# EAGLE schematic f91_main_board_nf (EAGLE 7.5.0)
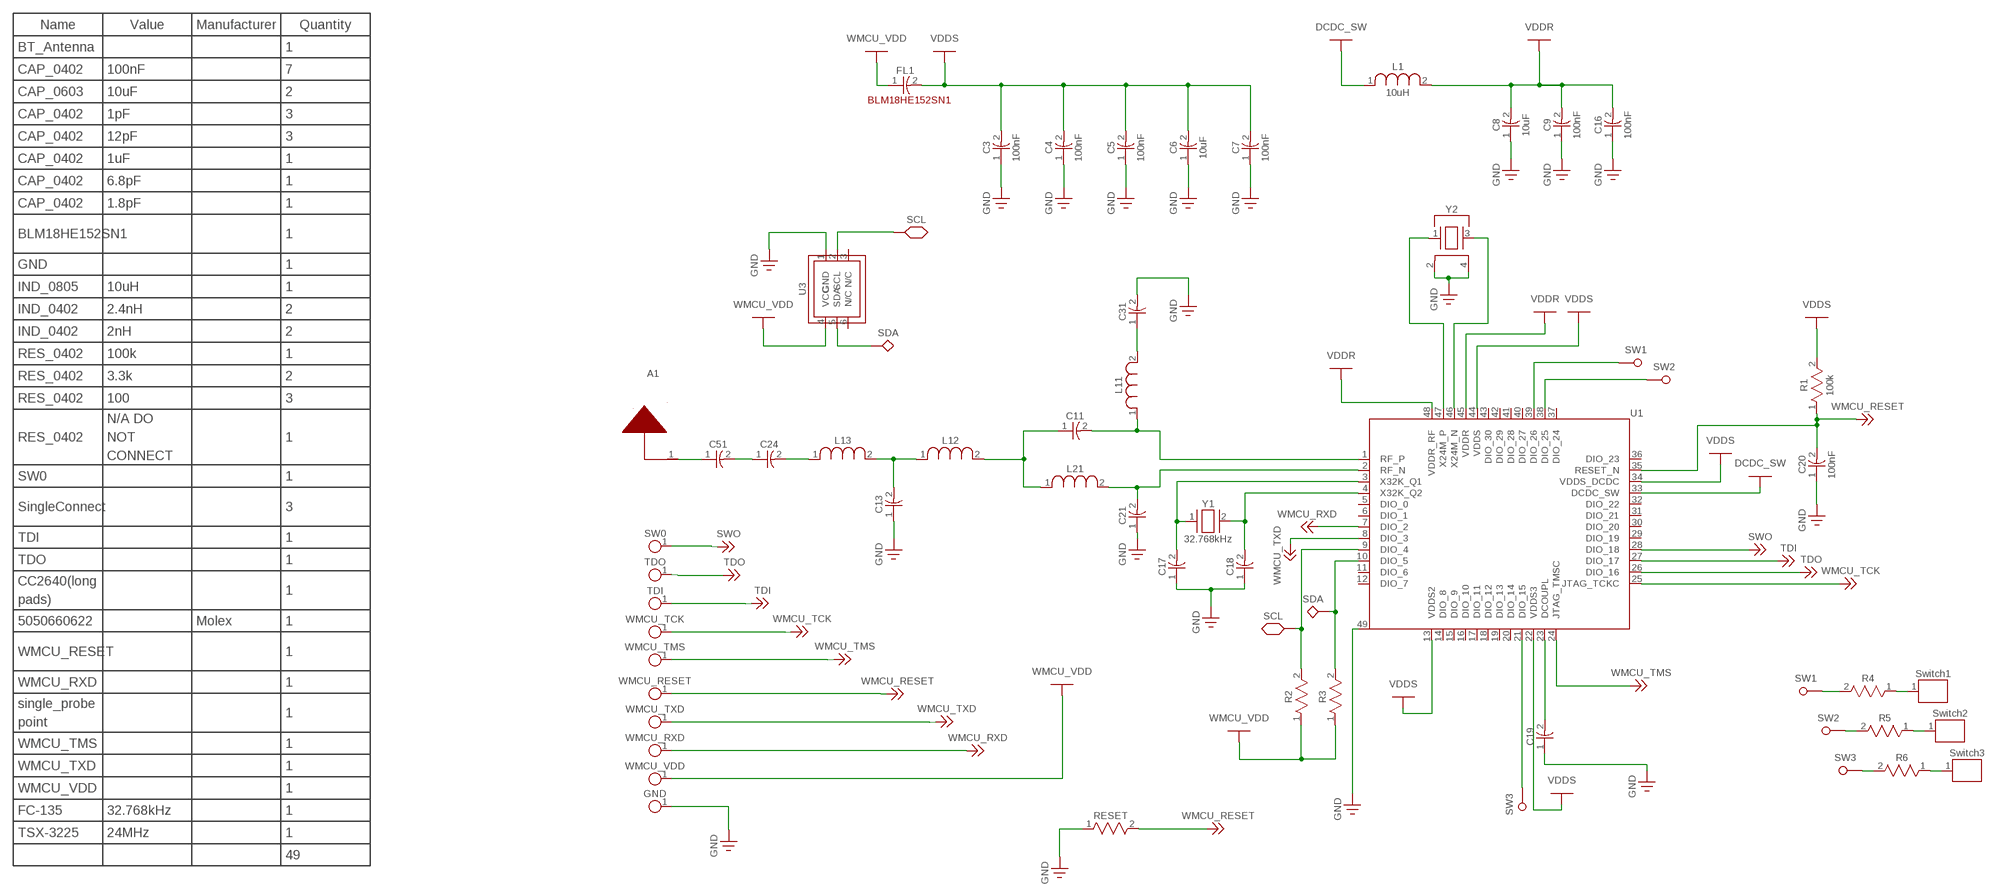
[diagram p0: schematic, sheet 1]

## Parts
A1  BT_ANTENNA  [BT_ANTENNA]
C3  100nF  CAP_0402  [CAP_0402]
C4  100nF  CAP_0402  [CAP_0402]
C5  100nF  CAP_0402  [CAP_0402]
C6  10uF  CAP_0603  [CAP_0603]
C7  100nF  CAP_0402  [CAP_0402]
C8  10uF  CAP_0603  [CAP_0603]
C9  100nF  CAP_0402  [CAP_0402]
C11  1pF  CAP_0402_20  [CAP_0402]
C13  1pF  CAP_0402_20  [CAP_0402]
C16  100nF  CAP_0402  [CAP_0402]
C17  12pF  CAP_0402_20  [CAP_0402]
C18  12pF  CAP_0402_20  [CAP_0402]
C19  1uF  CAP_0402_20  [CAP_0402]
C20  100nF  CAP_0402  [CAP_0402]
C21  1pF  CAP_0402_20  [CAP_0402]
C24  12pF  CAP_0402_20  [CAP_0402]
C31  6.8pF  CAP_0402_20  [CAP_0402]
C51  1.8pF  CAP_0402_20  [CAP_0402]
FL1  BLM18HE152SN1  [CAP_0603_31]
GND  GND  [SINGLE_PROBE_POINT]
L1  10uH  IND_0805  [IND_0805]
L11  2.4nH  IND_0402  [IND_0402]
L12  2nH  IND_0402  [IND_0402]
L13  2nH  IND_0402  [IND_0402]
L21  2.4nH  IND_0402  [IND_0402]
R1  100k  RES_0402  [RES_0402]
R2  3.3k  RES_0402_25  [RES_0402]
R3  3.3k  RES_0402_25  [RES_0402]
R4  100  RES_0402_26  [RES_0402]
R5  100  RES_0402_26  [RES_0402]
R6  100  RES_0402_26  [RES_0402]
RESET  N/A DO NOT CONNECT  RES_0402_25  [RES_0402]
SW0  SW0  [SINGLE_PROBE_POINT]
Switch1  SINGLECONNECT  [SINGLECONNECT]
Switch2  SINGLECONNECT  [SINGLECONNECT]
Switch3  SINGLECONNECT  [SINGLECONNECT]
TDI  TDI_45  [SINGLE_PROBE_POINT]
TDO  TDO_43  [SINGLE_PROBE_POINT]
U1  CC2640(LONG_PADS)  [RGZ0048A-VQFN-48(LONGER_PADS)]
U3  5050660622  [5050660622]
WMCU_RESET  WMCU_RESET_18  [SINGLE_PROBE_POINT]
WMCU_RXD  WMCU_RXD_48  [SINGLE_PROBE_POINT]
WMCU_TCK  SINGLE_PROBE_POINT  [SINGLE_PROBE_POINT]
WMCU_TMS  WMCU_TMS_6  [SINGLE_PROBE_POINT]
WMCU_TXD  WMCU_TXD_3  [SINGLE_PROBE_POINT]
WMCU_VDD  WMCU_VDD_23  [SINGLE_PROBE_POINT]
Y1  32.768kHz  FC-135  [FC-135]
Y2  24MHz  TSX-3225  [TSX-3225]

## Nets
Net_0: C3.1 C4.1 C5.1 C6.1 C7.1 C8.1 C9.1 C13.1 C16.1 C17.1 C18.1 C19.1 C20.1 C21.1 C31.2 GND.1 RESET.1 U1.49(GND) U3.1(GND) Y2.2 Y2.4 ; supply symbol labelled GND
Net_1: FL1.1 R2.1 R3.1 U3.4(VCC) WMCU_VDD.1 ; supply symbol labelled WMCU_VDD
Net_2: C3.2 C4.2 C5.2 C6.2 C7.2 FL1.2 R1.2 U1.13(VDDS2) U1.22(VDDS3) U1.34(VDDS_DCDC) U1.44(VDDS) ; supply symbol labelled VDDS
Net_3: L1.1 U1.33(DCDC_SW) ; supply symbol labelled DCDC_SW
Net_4: C8.2 C9.2 C16.2 L1.2 U1.45(VDDR) U1.48(VDDR_RF) ; supply symbol labelled VDDR
Net_5: U1.25(JTAG_TCKC) WMCU_TCK.1 ; supply symbol labelled WMCU_TCK
Net_6: U1.24(JTAG_TMSC) WMCU_TMS.1 ; supply symbol labelled WMCU_TMS
Net_7: C20.2 R1.1 RESET.2 U1.35(RESET_N) WMCU_RESET.1 ; supply symbol labelled WMCU_RESET
Net_8: C17.2 U1.3(X32K_Q1) Y1.1
Net_9: C18.2 U1.4(X32K_Q2) Y1.2
Net_10: C19.2 U1.23(DCOUPL)
Net_11: U1.47(X24M_P) Y2.1
Net_12: U1.46(X24M_N) Y2.3
Net_13: C21.2 L21.2 U1.2(RF_N)
Net_14: C11.2 L11.1 U1.1(RF_P)
Net_15: C31.1 L11.2
Net_16: C11.1 L12.2 L21.1
Net_17: C13.2 L12.1 L13.2
Net_18: C24.2 L13.1
Net_19: C24.1 C51.2
Net_20: A1.1 C51.1
Net_21: U1.7(DIO_2) WMCU_RXD.1 ; supply symbol labelled WMCU_RXD
Net_22: U1.8(DIO_3) WMCU_TXD.1 ; supply symbol labelled WMCU_TXD
Net_23: TDO.1 U1.26(DIO_16) ; supply symbol labelled TDO
Net_24: TDI.1 U1.27(DIO_17) ; supply symbol labelled TDI
Net_25: SW0.1 U1.28(DIO_18) ; supply symbol labelled SWO
Net_30: R3.2 U1.10(DIO_5) U3.5(SDA) ; supply symbol labelled SDA
Net_31: R2.2 U1.9(DIO_4) U3.2(SCL) ; supply symbol labelled SCL
Net_32: R6.2 U1.21(DIO_15) ; supply symbol labelled SW3
Net_33: R5.2 U1.38(DIO_25) ; supply symbol labelled SW2
Net_34: R4.2 U1.39(DIO_26) ; supply symbol labelled SW1
Net_35: R4.1 Switch1.1
Net_36: R5.1 Switch2.1
Net_37: R6.1 Switch3.1
Unconnected: U1.5(DIO_0) U1.6(DIO_1) U1.11(DIO_6) U1.12(DIO_7) U1.14(DIO_8) U1.15(DIO_9) U1.16(DIO_10) U1.17(DIO_11) U1.18(DIO_12) U1.19(DIO_13) U1.20(DIO_14) U1.29(DIO_19) U1.30(DIO_20) U1.31(DIO_21) U1.32(DIO_22) U1.36(DIO_23) U1.37(DIO_24) U1.40(DIO_27) U1.41(DIO_28) U1.42(DIO_29) U1.43(DIO_30) U3.3(N/C) U3.6(N/C)

## Notes on the sheet
- Name | Value | Manufacturer | Quantity
- BT_Antenna | 1
- CAP_0402 | 100nF | 7
- CAP_0603 | 10uF | 2
- CAP_0402 | 1pF | 3
- CAP_0402 | 12pF | 3
- CAP_0402 | 1uF | 1
- CAP_0402 | 6.8pF | 1
- CAP_0402 | 1.8pF | 1
- BLM18HE152SN1 | 1
- GND | 1
- IND_0805 | 10uH | 1
- IND_0402 | 2.4nH | 2
- IND_0402 | 2nH | 2
- RES_0402 | 100k | 1
- RES_0402 | 3.3k | 2
- RES_0402 | 100 | 3
- RES_0402
- N/A DO
  NOT
  CONNECT
- 1
- SW0 | 1
- SingleConnect | 3
- TDI | 1
- TDO | 1
- CC2640(long
  pads)
- 1
- 5050660622 | Molex | 1
- WMCU_RESET | 1
- WMCU_RXD | 1
- single_probe
  point
- 1
- WMCU_TMS | 1
- WMCU_TXD | 1
- WMCU_VDD | 1
- FC-135 | 32.768kHz | 1
- TSX-3225 | 24MHz | 1
- 49

## Library data of the parts
A1 = common:BT_ANTENNA
C3-C5 C7 C9 C16 C20 = common:CAP_0402
C6 C8 = common:CAP_0603
C11 C13 C21 = common:CAP_0402_20
C17-C19 C24 C31 C51 = common:CAP_0402_20; VALUE: 1pF
FL1 = common:BLM18HE152SN1
GND = common:GND
L1 = common:IND_0805
L11 L21 = common:IND_0402
L12 L13 = common:IND_0402; VALUE: 2.4nH
R1 = common:RES_0402
R2 R3 = common:RES_0402_25
R4-R6 = common:RES_0402_26
RESET = common:RES_0402_25; VALUE: 3.3k
SW0 = common:SW0
Switch1-Switch3 = common:SINGLECONNECT
TDI = common:TDI_45
TDO = common:TDO_43
U1 = common:CC2640(LONG_PADS)
U3 = common:5050660622; MANUFACTURER: Molex
WMCU_RESET = common:WMCU_RESET_18
WMCU_RXD = common:WMCU_RXD_48
WMCU_TCK = common:SINGLE_PROBE_POINT
WMCU_TMS = common:WMCU_TMS_6
WMCU_TXD = common:WMCU_TXD_3
WMCU_VDD = common:WMCU_VDD_23
Y1 = common:FC-135
Y2 = common:TSX-3225